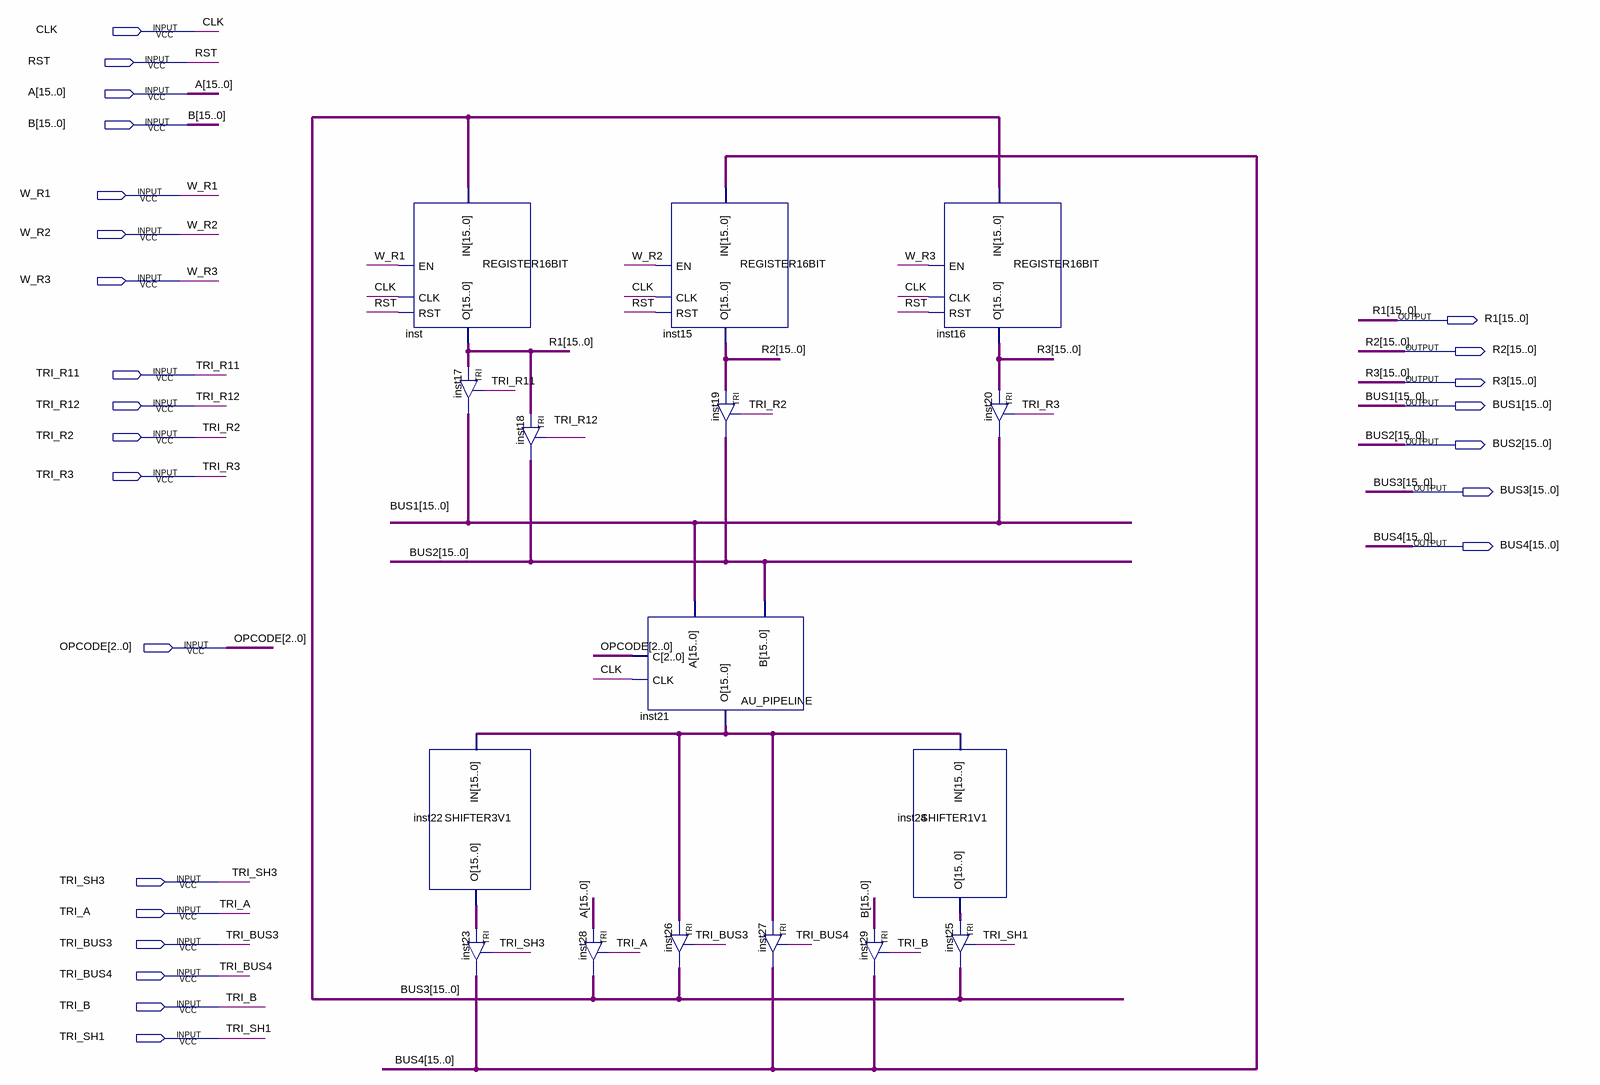
[diagram p0: schematic sheet]
// Quartus schematic TEST.bdf as structural Verilog: 16 symbols, 25 pins
module TEST (
  input  CLK,
  input  RST,
  input  [15:0] A,
  input  [15:0] B,
  input  W_R1,
  input  W_R2,
  input  W_R3,
  input  TRI_R11,
  input  TRI_R12,
  input  TRI_R2,
  input  TRI_R3,
  input  [2:0] OPCODE,
  input  TRI_SH3,
  input  TRI_A,
  input  TRI_BUS3,
  input  TRI_BUS4,
  input  TRI_B,
  input  TRI_SH1,
  output [15:0] R1,
  output [15:0] R2,
  output [15:0] R3,
  output [15:0] BUS1,
  output [15:0] BUS2,
  output [15:0] BUS3,
  output [15:0] BUS4
);

  wire [15:0] inst21_o, inst22_o, inst24_o;

  REGISTER16BIT inst (.IN(BUS3), .EN(W_R1), .CLK(CLK), .RST(RST), .O(R1));
  SHIFTER3V1 inst22 (.IN(inst21_o), .O(inst22_o));
  TRI inst17[15:0] (.IN(R1), .OE(TRI_R11), .OUT(BUS1));
  TRI inst23[15:0] (.IN(inst22_o), .OE(TRI_SH3), .OUT(BUS4));
  TRI inst18[15:0] (.IN(R1), .OE(TRI_R12), .OUT(BUS2));
  TRI inst28[15:0] (.IN(A), .OE(TRI_A), .OUT(BUS3));
  REGISTER16BIT inst15 (.IN(BUS4), .EN(W_R2), .CLK(CLK), .RST(RST), .O(R2));
  AU_PIPELINE inst21 (.A(BUS1), .B(BUS2), .C(OPCODE), .CLK(CLK), .O(inst21_o));
  TRI inst26[15:0] (.IN(inst21_o), .OE(TRI_BUS3), .OUT(BUS3));
  TRI inst19[15:0] (.IN(R2), .OE(TRI_R2), .OUT(BUS2));
  TRI inst27[15:0] (.IN(inst21_o), .OE(TRI_BUS4), .OUT(BUS4));
  TRI inst29[15:0] (.IN(B), .OE(TRI_B), .OUT(BUS4));
  REGISTER16BIT inst16 (.IN(BUS3), .EN(W_R3), .CLK(CLK), .RST(RST), .O(R3));
  SHIFTER1V1 inst24 (.IN(inst21_o), .O(inst24_o));
  TRI inst20[15:0] (.IN(R3), .OE(TRI_R3), .OUT(BUS1));
  TRI inst25[15:0] (.IN(inst24_o), .OE(TRI_SH1), .OUT(BUS3));
endmodule
